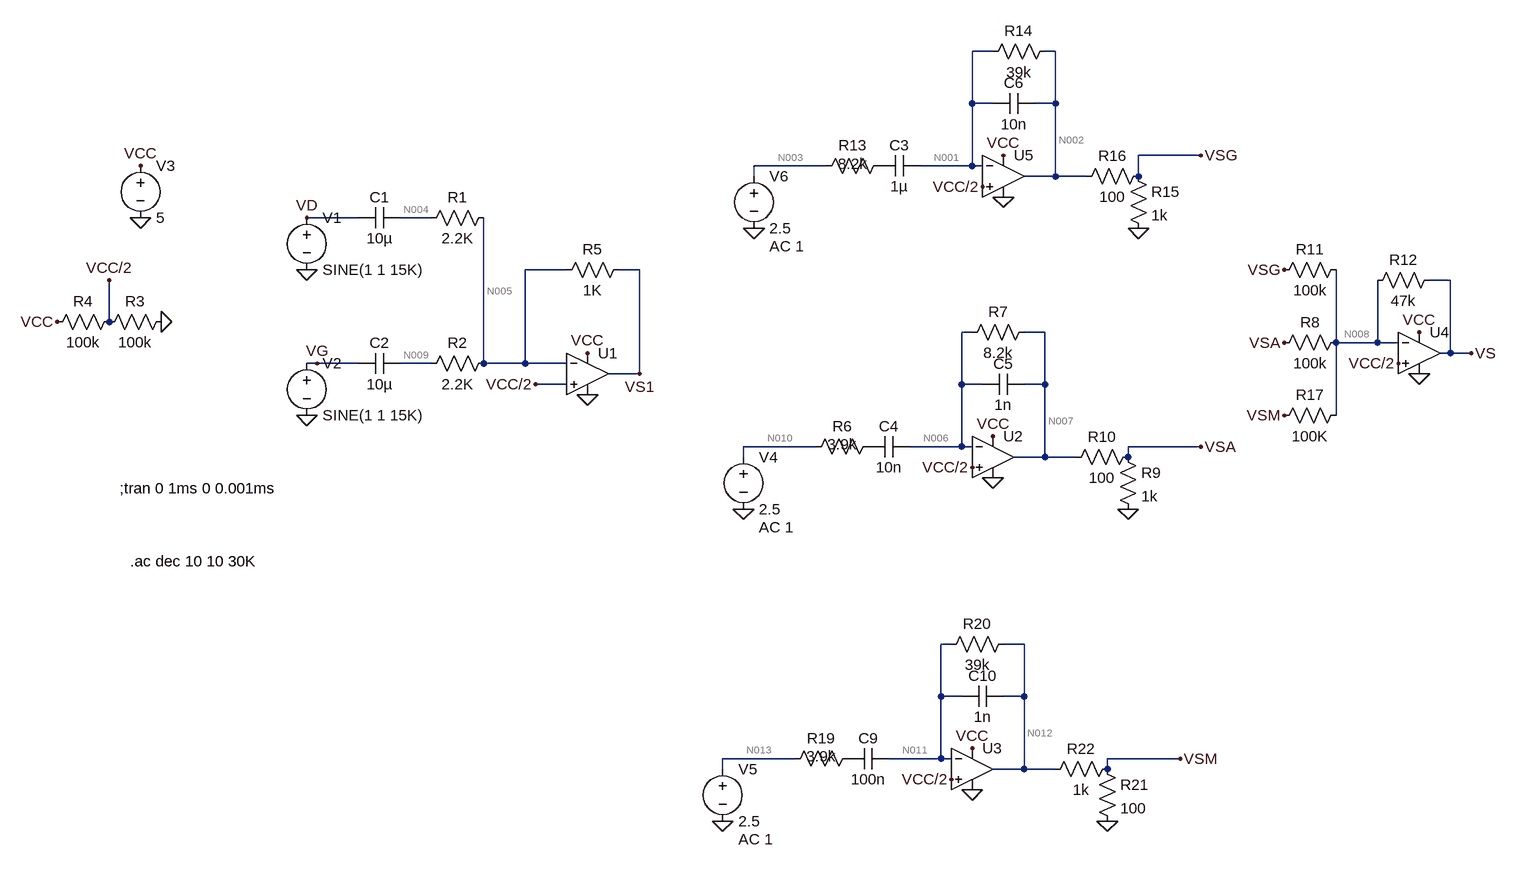
[diagram p0: schematic Montage1.asc]
Montage1.asc, the LTspice schematic file:
Version 4
SHEET 1 2012 1212
WIRE 1088 -320 1056 -320
WIRE 1184 -320 1168 -320
WIRE 1056 -240 1056 -320
WIRE 1088 -240 1056 -240
WIRE 1184 -240 1184 -320
WIRE 1184 -240 1152 -240
WIRE 1408 -160 1312 -160
WIRE 832 -144 720 -144
WIRE 1056 -144 1056 -240
WIRE 1056 -144 976 -144
WIRE 1072 -144 1056 -144
WIRE 720 -128 720 -144
WIRE 1184 -128 1184 -240
WIRE 1184 -128 1136 -128
WIRE 1232 -128 1184 -128
WIRE 1312 -128 1312 -160
WIRE 112 -64 32 -64
WIRE 224 -64 176 -64
WIRE 432 16 368 16
WIRE 544 16 512 16
WIRE 1792 32 1760 32
WIRE -272 96 -272 32
WIRE 1056 112 1040 112
WIRE 1168 112 1136 112
WIRE 1616 128 1616 16
WIRE 1680 128 1680 32
WIRE 1680 128 1616 128
WIRE 1712 128 1680 128
WIRE 1792 144 1792 32
WIRE 1792 144 1776 144
WIRE 1824 144 1792 144
WIRE 48 160 32 160
WIRE 112 160 48 160
WIRE 224 160 176 160
WIRE 304 160 304 -64
WIRE 368 160 368 16
WIRE 368 160 304 160
WIRE 432 160 368 160
WIRE 544 176 544 16
WIRE 544 176 496 176
WIRE 432 192 384 192
WIRE 1040 192 1040 112
WIRE 1072 192 1040 192
WIRE 1168 192 1168 112
WIRE 1168 192 1136 192
WIRE 1616 240 1616 128
WIRE 816 288 704 288
WIRE 1040 288 1040 192
WIRE 1040 288 960 288
WIRE 1056 288 1040 288
WIRE 1408 288 1296 288
WIRE 704 304 704 288
WIRE 1168 304 1168 192
WIRE 1168 304 1120 304
WIRE 1216 304 1168 304
WIRE 1296 304 1296 288
WIRE 1024 592 1008 592
WIRE 1136 592 1104 592
WIRE 1008 672 1008 592
WIRE 1040 672 1008 672
WIRE 1136 672 1136 592
WIRE 1136 672 1104 672
WIRE 784 768 672 768
WIRE 1008 768 1008 672
WIRE 1008 768 928 768
WIRE 1024 768 1008 768
WIRE 1376 768 1264 768
WIRE 672 784 672 768
WIRE 1136 784 1136 672
WIRE 1136 784 1088 784
WIRE 1184 784 1136 784
WIRE 1264 784 1264 768
FLAG -192 96 0
FLAG -224 -64 0
FLAG -224 -144 VCC
FLAG -352 96 VCC
FLAG 464 144 VCC
FLAG 464 208 0
FLAG 544 176 VS1
FLAG 32 16 0
FLAG 32 240 0
FLAG 32 -64 VD
FLAG 48 160 VG
FLAG -272 32 VCC/2
FLAG 384 192 VCC/2
FLAG 1744 176 0
FLAG 1744 112 VCC
FLAG 1536 16 VSG
FLAG 1536 128 VSA
FLAG 1824 144 VS
FLAG 1712 160 VCC/2
FLAG 1104 -96 0
FLAG 1104 -160 VCC
FLAG 1072 -112 VCC/2
FLAG 720 -48 0
FLAG 1312 -48 0
FLAG 1088 336 0
FLAG 1088 272 VCC
FLAG 1056 320 VCC/2
FLAG 704 384 0
FLAG 1296 384 0
FLAG 1408 -160 VSG
FLAG 1408 288 VSA
FLAG 1056 816 0
FLAG 1056 752 VCC
FLAG 1024 800 VCC/2
FLAG 672 864 0
FLAG 1264 864 0
FLAG 1376 768 VSM
FLAG 1536 240 VSM
SYMBOL voltage 32 -80 R0
WINDOW 123 0 0 Left 0
WINDOW 39 24 44 Left 2
SYMATTR InstName V1
SYMATTR Value SINE(1 1 15K)
SYMBOL voltage 32 144 R0
WINDOW 123 0 0 Left 0
WINDOW 39 24 124 Left 2
SYMATTR InstName V2
SYMATTR Value SINE(1 1 15K)
SYMBOL res 320 -80 R90
WINDOW 0 0 56 VBottom 2
WINDOW 3 32 56 VTop 2
SYMATTR InstName R1
SYMATTR Value 2.2K
SYMBOL res 320 144 R90
WINDOW 0 0 56 VBottom 2
WINDOW 3 32 56 VTop 2
SYMATTR InstName R2
SYMATTR Value 2.2K
SYMBOL cap 176 -80 R90
WINDOW 0 0 32 VBottom 2
WINDOW 3 32 32 VTop 2
SYMATTR InstName C1
SYMATTR Value 10µ
SYMBOL cap 176 144 R90
WINDOW 0 0 32 VBottom 2
WINDOW 3 32 32 VTop 2
SYMATTR InstName C2
SYMATTR Value 10µ
SYMBOL Opamps\\UniversalOpamp2 464 176 R0
SYMATTR InstName U1
SYMBOL res -176 80 R90
WINDOW 0 0 56 VBottom 2
WINDOW 3 32 56 VTop 2
SYMATTR InstName R3
SYMATTR Value 100k
SYMBOL res -256 80 R90
WINDOW 0 0 56 VBottom 2
WINDOW 3 32 56 VTop 2
SYMATTR InstName R4
SYMATTR Value 100k
SYMBOL voltage -224 -160 R0
WINDOW 123 0 0 Left 0
WINDOW 39 0 0 Left 0
SYMATTR InstName V3
SYMATTR Value 5
SYMBOL res 528 0 R90
WINDOW 0 0 56 VBottom 2
WINDOW 3 32 56 VTop 2
SYMATTR InstName R5
SYMATTR Value 1K
SYMBOL Opamps\\UniversalOpamp2 1744 144 R0
SYMATTR InstName U4
SYMBOL res 1632 112 R90
WINDOW 0 0 56 VBottom 2
WINDOW 3 32 56 VTop 2
SYMATTR InstName R8
SYMATTR Value 100k
SYMBOL res 1632 0 R90
WINDOW 0 0 56 VBottom 2
WINDOW 3 32 56 VTop 2
SYMATTR InstName R11
SYMATTR Value 100k
SYMBOL res 1776 16 R90
WINDOW 0 0 56 VBottom 2
WINDOW 3 32 56 VTop 2
SYMATTR InstName R12
SYMATTR Value 47k
SYMBOL res 928 -160 R90
WINDOW 0 0 56 VBottom 2
WINDOW 3 28 56 VBottom 2
SYMATTR InstName R13
SYMATTR Value 8.2k
SYMBOL cap 976 -160 R90
WINDOW 0 0 32 VBottom 2
WINDOW 3 32 32 VTop 2
SYMATTR InstName C3
SYMATTR Value 1µ
SYMBOL res 1184 -336 R90
WINDOW 0 0 56 VBottom 2
WINDOW 3 32 56 VTop 2
SYMATTR InstName R14
SYMATTR Value 39k
SYMBOL Opamps\\UniversalOpamp2 1104 -128 R0
SYMATTR InstName U5
SYMBOL voltage 720 -144 R0
WINDOW 123 24 124 Left 2
WINDOW 39 0 0 Left 0
SYMATTR Value2 AC 1
SYMATTR InstName V6
SYMATTR Value 2.5
SYMBOL cap 1152 -256 R90
WINDOW 0 0 32 VBottom 2
WINDOW 3 32 32 VTop 2
SYMATTR InstName C6
SYMATTR Value 10n
SYMBOL res 1296 -144 R0
SYMATTR InstName R15
SYMATTR Value 1k
SYMBOL res 1328 -144 R90
WINDOW 0 0 56 VBottom 2
WINDOW 3 32 56 VTop 2
SYMATTR InstName R16
SYMATTR Value 100
SYMBOL res 912 272 R90
WINDOW 0 0 56 VBottom 2
WINDOW 3 28 56 VBottom 2
SYMATTR InstName R6
SYMATTR Value 3.9k
SYMBOL cap 960 272 R90
WINDOW 0 0 32 VBottom 2
WINDOW 3 32 32 VTop 2
SYMATTR InstName C4
SYMATTR Value 10n
SYMBOL res 1152 96 R90
WINDOW 0 0 56 VBottom 2
WINDOW 3 32 56 VTop 2
SYMATTR InstName R7
SYMATTR Value 8.2k
SYMBOL Opamps\\UniversalOpamp2 1088 304 R0
SYMATTR InstName U2
SYMBOL voltage 704 288 R0
WINDOW 123 24 124 Left 2
WINDOW 39 0 0 Left 0
SYMATTR Value2 AC 1
SYMATTR InstName V4
SYMATTR Value 2.5
SYMBOL cap 1136 176 R90
WINDOW 0 0 32 VBottom 2
WINDOW 3 32 32 VTop 2
SYMATTR InstName C5
SYMATTR Value 1n
SYMBOL res 1280 288 R0
SYMATTR InstName R9
SYMATTR Value 1k
SYMBOL res 1312 288 R90
WINDOW 0 0 56 VBottom 2
WINDOW 3 32 56 VTop 2
SYMATTR InstName R10
SYMATTR Value 100
SYMBOL res 880 752 R90
WINDOW 0 0 56 VBottom 2
WINDOW 3 28 56 VBottom 2
SYMATTR InstName R19
SYMATTR Value 3.9k
SYMBOL cap 928 752 R90
WINDOW 0 0 32 VBottom 2
WINDOW 3 32 32 VTop 2
SYMATTR InstName C9
SYMATTR Value 100n
SYMBOL res 1120 576 R90
WINDOW 0 0 56 VBottom 2
WINDOW 3 32 56 VTop 2
SYMATTR InstName R20
SYMATTR Value 39k
SYMBOL Opamps\\UniversalOpamp2 1056 784 R0
SYMATTR InstName U3
SYMBOL voltage 672 768 R0
WINDOW 123 24 124 Left 2
WINDOW 39 0 0 Left 0
SYMATTR Value2 AC 1
SYMATTR InstName V5
SYMATTR Value 2.5
SYMBOL cap 1104 656 R90
WINDOW 0 0 32 VBottom 2
WINDOW 3 32 32 VTop 2
SYMATTR InstName C10
SYMATTR Value 1n
SYMBOL res 1248 768 R0
SYMATTR InstName R21
SYMATTR Value 100
SYMBOL res 1280 768 R90
WINDOW 0 0 56 VBottom 2
WINDOW 3 32 56 VTop 2
SYMATTR InstName R22
SYMATTR Value 1k
SYMBOL res 1520 256 R270
WINDOW 0 32 56 VTop 2
WINDOW 3 0 56 VBottom 2
SYMATTR InstName R17
SYMATTR Value 100K
TEXT -256 352 Left 2 !;tran 0 1ms 0 0.001ms
TEXT -240 464 Left 2 !.ac dec 10 10 30K

The netlist it stands for:
* Montage1.asc
V1 VD 0 SINE(1 1 15K)
V2 VG 0 SINE(1 1 15K)
R1 N005 N004 2.2K
R2 N005 N009 2.2K
C1 N004 VD 10µ
C2 N009 VG 10µ
XU1 VCC/2 N005 VCC 0 VS1 level.2 Avol=1Meg GBW=10Meg Slew=10Meg ilimit=25m rail=0 Vos=0 phimargin=45 en=0 enk=0 in=0 ink=0 Rin=500Meg  ; pins IN+ IN- V+ V- OUT
R3 0 VCC/2 100k
R4 VCC/2 VCC 100k
V3 VCC 0 5
R5 VS1 N005 1K
XU4 VCC/2 N008 VCC 0 VS level.2 Avol=1Meg GBW=10Meg Slew=10Meg ilimit=25m rail=0 Vos=0 phimargin=45 en=0 enk=0 in=0 ink=0 Rin=500Meg  ; pins IN+ IN- V+ V- OUT
R8 N008 VSA 100k
R11 N008 VSG 100k
R12 VS N008 47k
R13 P001 N003 8.2k
C3 N001 P001 1µ
R14 N002 N001 39k
XU5 VCC/2 N001 VCC 0 N002 level.2 Avol=1Meg GBW=10Meg Slew=10Meg ilimit=25m rail=0 Vos=0 phimargin=45 en=0 enk=0 in=0 ink=0 Rin=500Meg  ; pins IN+ IN- V+ V- OUT
V6 N003 0 2.5 AC 1
C6 N002 N001 10n
R15 VSG 0 1k
R16 VSG N002 100
R6 P002 N010 3.9k
C4 N006 P002 10n
R7 N007 N006 8.2k
XU2 VCC/2 N006 VCC 0 N007 level.2 Avol=1Meg GBW=10Meg Slew=10Meg ilimit=25m rail=0 Vos=0 phimargin=45 en=0 enk=0 in=0 ink=0 Rin=500Meg  ; pins IN+ IN- V+ V- OUT
V4 N010 0 2.5 AC 1
C5 N007 N006 1n
R9 VSA 0 1k
R10 VSA N007 100
R19 P003 N013 3.9k
C9 N011 P003 100n
R20 N012 N011 39k
XU3 VCC/2 N011 VCC 0 N012 level.2 Avol=1Meg GBW=10Meg Slew=10Meg ilimit=25m rail=0 Vos=0 phimargin=45 en=0 enk=0 in=0 ink=0 Rin=500Meg  ; pins IN+ IN- V+ V- OUT
V5 N013 0 2.5 AC 1
C10 N012 N011 1n
R21 VSM 0 100
R22 VSM N012 1k
R17 VSM N008 100K
;tran 0 1ms 0 0.001ms
.ac dec 10 10 30K
.lib UniversalOpamps2.sub
.backanno
.end

* Results of the author's LTspice run, read from the files saved beside the schematic
* Operating Point, zero values left out:
*   V(vd) = 1 V
*   V(vg) = 1 V
*   V(n005) = 2.5 V
*   V(n004) = 2.5 V
*   V(n009) = 2.5 V
*   V(vs1) = 2.5 V
*   V(vcc) = 5 V
*   V(vcc/2) = 2.5 V
*   V(vs) = 3.781 V
*   V(n008) = 2.5 V
*   V(vsa) = 2.273 V
*   V(vsg) = 2.273 V
*   V(p001) = 2.5 V
*   V(n003) = 2.5 V
*   V(n001) = 2.5 V
*   V(n002) = 2.5 V
*   V(p002) = 2.5 V
*   V(n010) = 2.5 V
*   V(n006) = 2.5 V
*   V(n007) = 2.5 V
*   V(p003) = 2.5 V
*   V(n013) = 2.5 V
*   V(n011) = 2.5 V
*   V(n012) = 2.5 V
*   V(vsm) = 229.3 mV
*   I(R17) = -22.71 µA
*   I(R22) = -2.271 mA
*   I(R21) = 2.293 mA
*   I(R10) = -2.271 mA
*   I(R9) = 2.273 mA
*   I(R16) = -2.271 mA
*   I(R15) = 2.273 mA
*   I(R12) = 27.25 µA
*   I(R11) = 2.271 µA
*   I(R8) = 2.271 µA
*   I(R4) = -25 µA
*   I(R3) = -25 µA
*   I(V3) = -7.397 mA
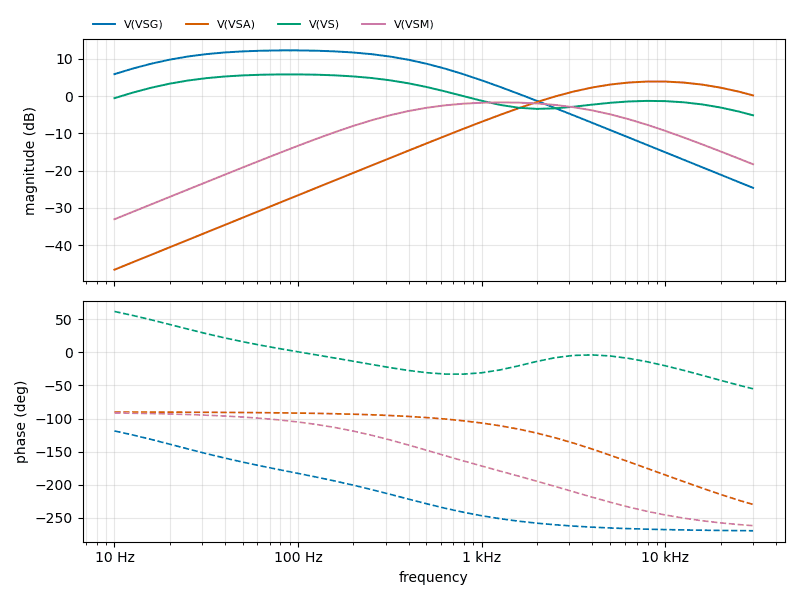
[diagram p1: AC Analysis of Montage1.asc, plotted from the saved traces]
* AC Analysis, 1 run:
*   V(VSG): 5.92 dB at 10 Hz, -24.62 dB at 30 kHz, peak 12.30 dB at 79.43 Hz, 3 dB below the peak at 17.86 Hz and 443.4 Hz
*   V(VSA): -46.60 dB at 10 Hz, 0.22 dB at 30 kHz, peak 3.93 dB at 7.943 kHz, 3 dB below the peak at 2.984 kHz and 26.47 kHz
*   V(VS): -0.53 dB at 10 Hz, -5.13 dB at 30 kHz, peak 5.85 dB at 100 Hz, 3 dB below the peak at 17.88 Hz and 459.5 Hz
*   V(VSM): -33.05 dB at 10 Hz, -18.28 dB at 30 kHz, peak -1.66 dB at 1.259 kHz, 3 dB below the peak at 346.3 Hz and 4.798 kHz